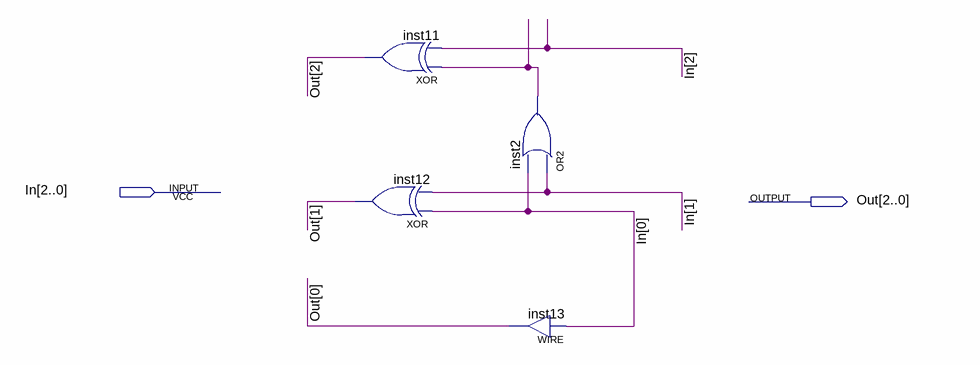
[diagram p0: schematic sheet]
// Quartus schematic Complement.bdf as structural Verilog: 4 symbols, 2 pins
module Complement (
  input  [2:0] In,
  output [2:0] Out
);

  wire inst2_out;

  xor inst11 (Out[2], inst2_out, In[2]);
  xor inst12 (Out[1], In[0], In[1]);
  or inst2 (inst2_out, In[1], In[0]);
  assign Out[0] = In[0];  // WIRE inst13
endmodule
